# EasyEDA schematic SCH_ZeeShield - GW Zb Shield For ESP32 ETH_2021-08-23.json

## Sheets
1 Main: TITLE: ZeeShield - GW Zb Shield For ESP32 ETH; REV: 1.0; Date: 2021-08-19; Sheet: 1/2; Drawn By: TrimVa; Company: Tech4You
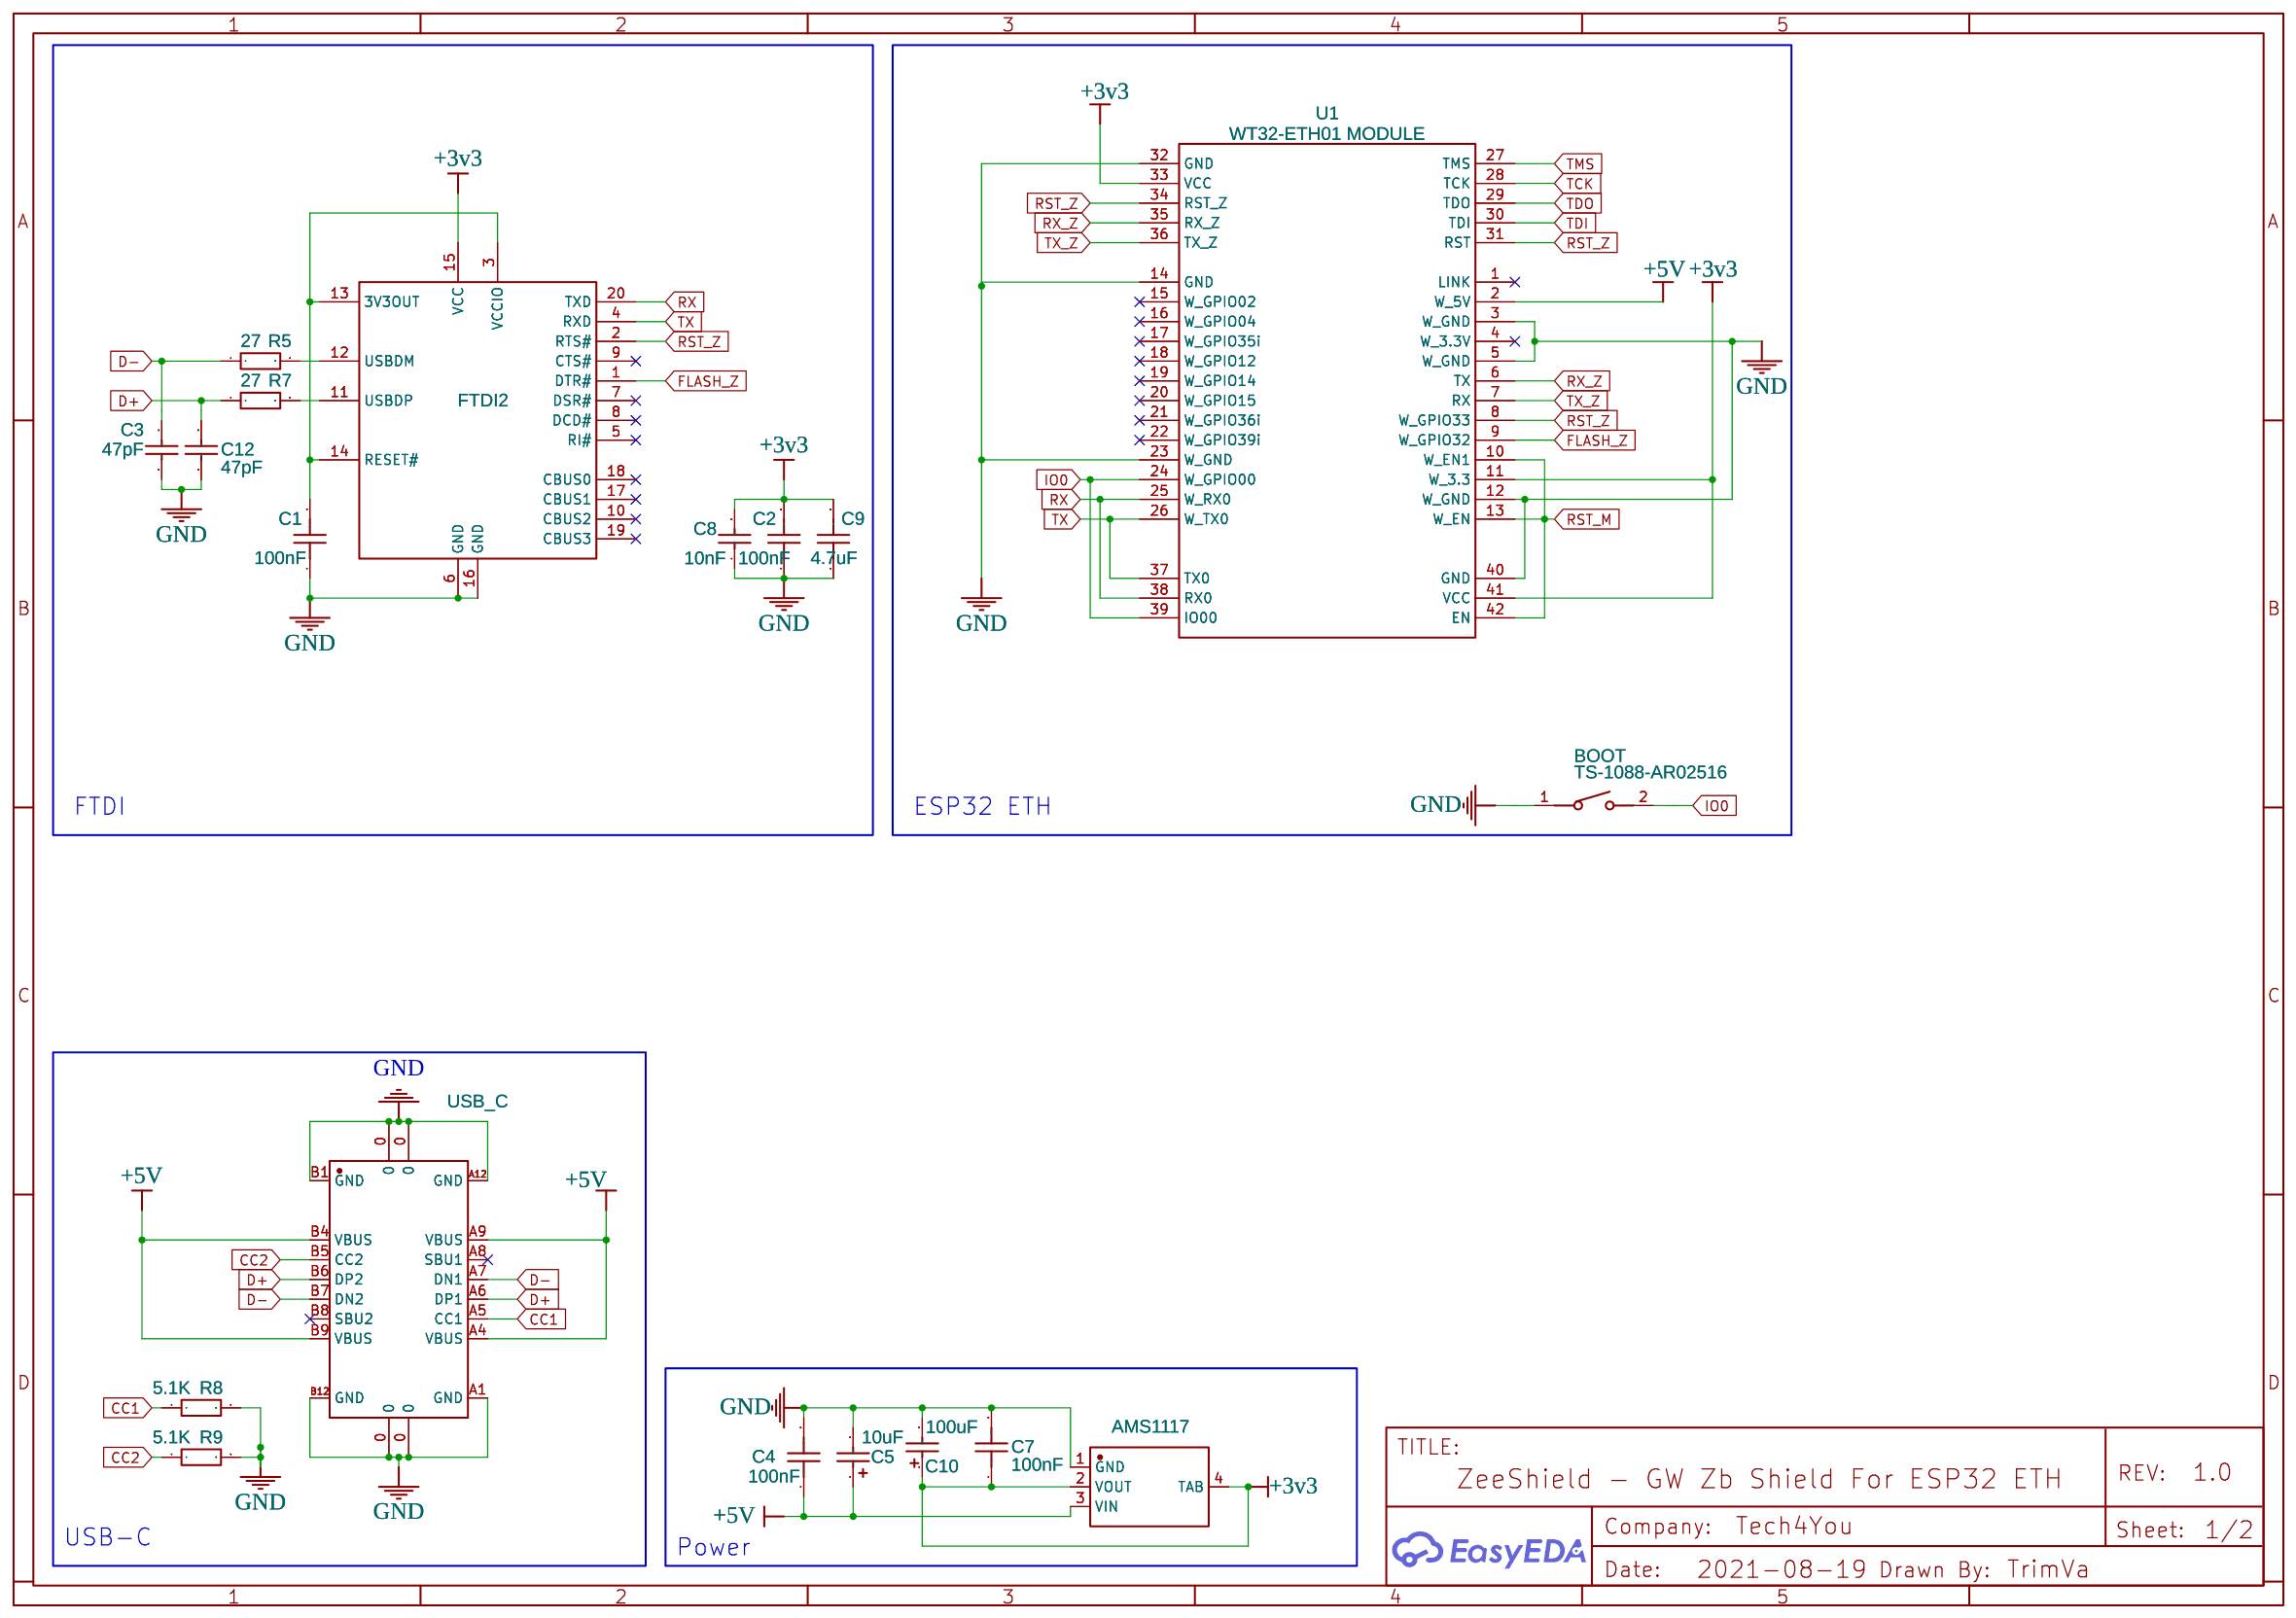
[diagram p0: Main]
2 ZigBee: Date: 2021-08-17; Sheet: 2/2
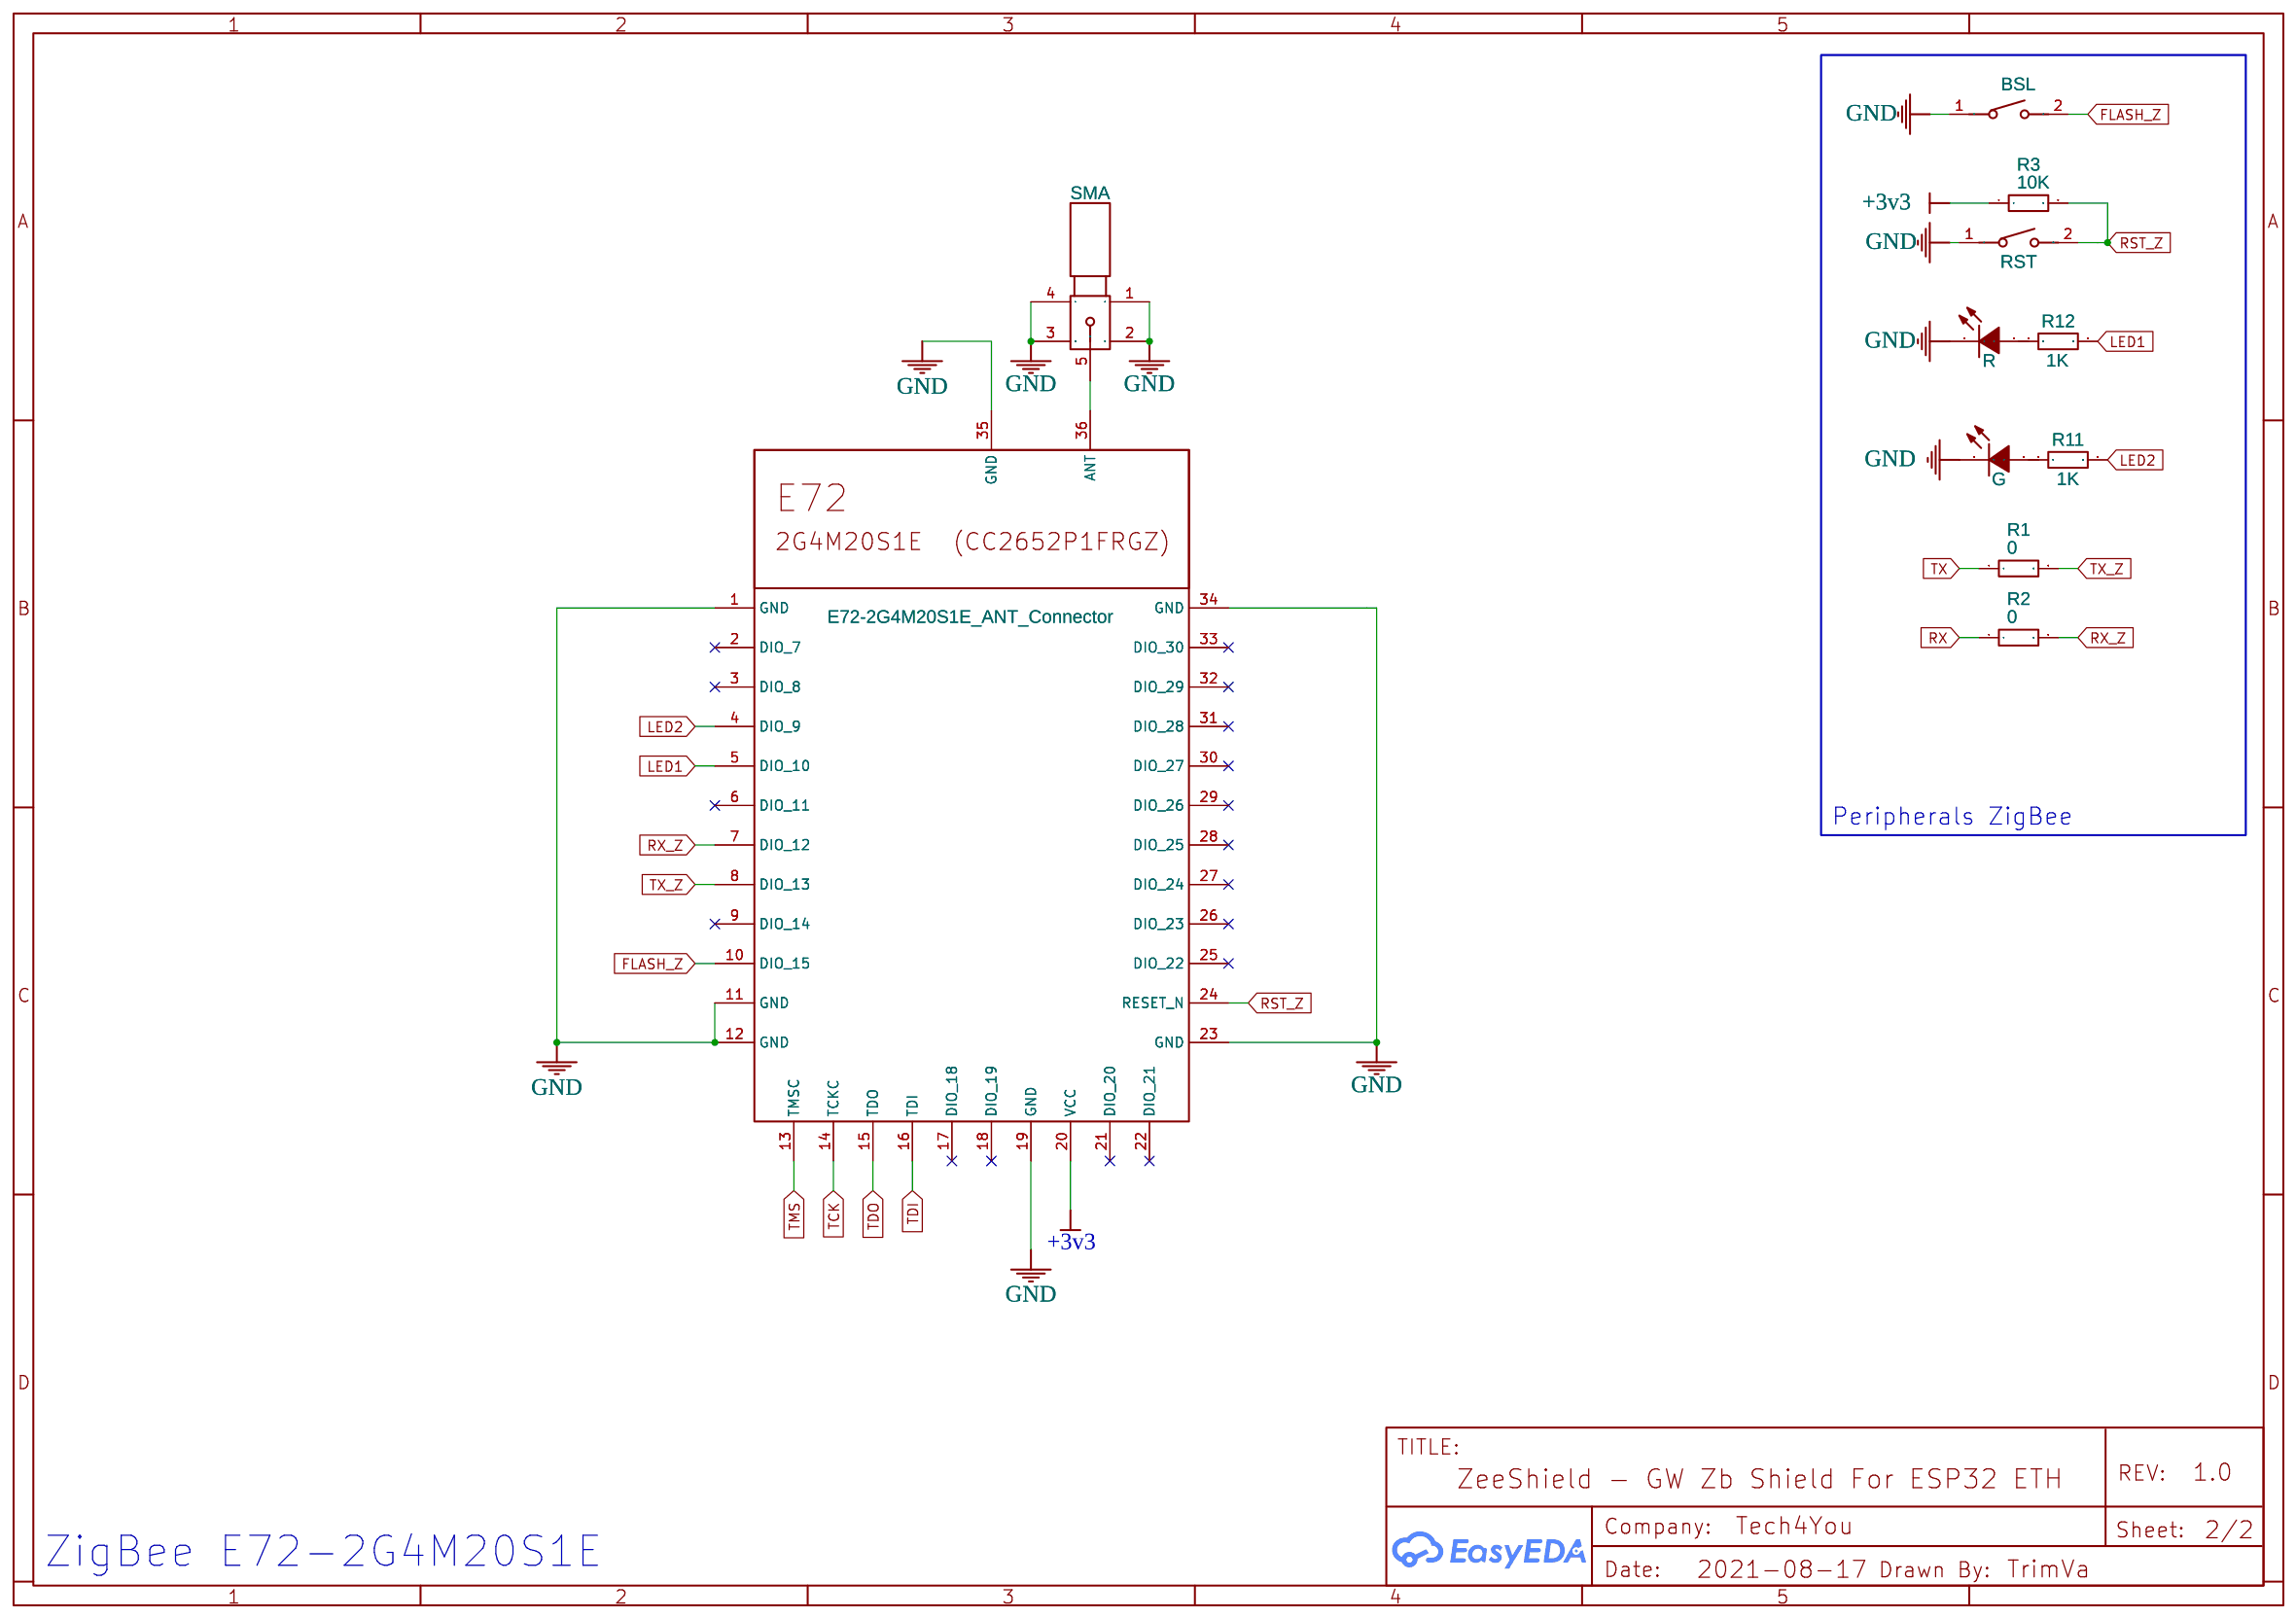
[diagram p1: ZigBee]

## Parts
sheet Main
AMS1117  AMS1117-3.3_C351784  [SOT-223-3_L6.5-W3.4-P2.30-LS7.0-BR]
BOOT  TS-1088-AR02516  [SW-SMD_L4.0-W2.9-LS4.8-1]
C1  100nF  [C0402]
C2  100nF  [C0402]
C3  47pF  [C0402]
C4  100nF  [C0402]
C5  10uF  [CAP-SMD_L3.2-W1.6-R-RD]
C7  100nF  [C0402]
C8  10nF  [C0402]
C9  4.7uF  [C0402]
C10  100uF  [CAP-SMD_L3.2-W1.6-R-RD]
C12  47pF  [C0402]
FTDI2  FT231XS-R  [SSOP-20_L8.6-W3.9-P0.64-LS6.0-BL]
R5  27  [R0402]
R7  27  [R0402]
R8  5.1K  [R0402]
R9  5.1K  [R0402]
U1  WT32-ETH01 MODULE  [WT32-ETH01-M MODULE]
USB_C  TYPE-C-31-M-12  [USB-C_SMD-TYPE-C-31-M-12]
sheet ZigBee
BSL  TS-1088-AR02516  [SW-SMD_L4.0-W2.9-LS4.8-1]
G  G  [LED0805-RD]
GND1  E72-2G4M20S1E_ANT_Connector  [E72-2G4M20S1E ANT_CONNECTOR]
R  R  [LED0805-RD]
R1  0  [R0402]
R2  0  [R0402]
R3  10K  [R0402]
R11  1K  [R0402]
R12  1K  [R0402]
RST  TS-1088-AR02516  [SW-SMD_L4.0-W2.9-LS4.8-1]
SMA  BWSMA-KE-P001  [SMA-SMD_BWSMA-KE-P001]

## Library data of the parts
AMS1117 = AMS1117-3.3_C351784: Supplier: LCSC; Supplier Part: C351784; Manufacturer: PUOLOP; Manufacturer Part: AMS1117-3.3; Contributor: LCSC; JLCPCB Part Class: Extended Part
BOOT BSL RST = TS-1088-AR02516: Supplier: LCSC; Supplier Part: C720478; Manufacturer: XUNPU; Contributor: LCSC; JLCPCB Part Class: Extended Part
C1 C2 C4 C7 = TCC0402X7R104K160AT: Supplier: LCSC; Supplier Part: C392963; Manufacturer: CCTC; Contributor: LCSC; JLCPCB Part Class: Extended Part
C3 C12 = CC0402JRNPO9BN470: Supplier: LCSC; Manufacturer: YAGEO; Supplier Part: C60137
C5 = TAJA106K016RNJ: Supplier: LCSC; Manufacturer: AVX; Supplier Part: C7171; JLCPCB Part Class: Basic Part
C8 = CC0402KRX7R9BB103: Supplier: LCSC; Manufacturer: YAGEO; Supplier Part: C60133
C9 = CL05A475MQ5NRNC_C307423: Supplier: LCSC; Supplier Part: C307423; Manufacturer: Samsung Electro-Mechanics; Manufacturer Part: CL05A475MQ5NRNC; Contributor: LCSC; JLCPCB Part Class: Extended Part
C10 = T490A107M006ATE800: Supplier: LCSC; Manufacturer: KEMET; Supplier Part: C122251; JLCPCB Part Class: Extended Part
FTDI2 = FT231XS-R: Supplier: LCSC; Manufacturer: FTDI; Contributor: LCSC; Supplier Part: C132160; JLCPCB Part Class: Extended Part
R5 R7 = 0402WGJ0270TCE: Supplier: LCSC; Manufacturer: UniOhm; Supplier Part: C25156; JLCPCB Part Class: Extended Part
R8 R9 = RC-02W512JT: Supplier: LCSC; Supplier Part: C258132; Manufacturer: Guangdong Fenghua Advanced Tech; Contributor: LCSC; JLCPCB Part Class: Extended Part
U1 = WT32-ETH01 MODULE: Manufacturer: Wireless-Tag; Manufacturer Part: WT32-ETH01; Supplier Part: WT32-ETH01; link: http://www.wireless-tag.com/wp-content/uploads/2020/08/WT32-ETH01规格书V1.2EN（英文）.pdf; Contributor: Antongsm
USB_C = TYPE-C-31-M-12: Supplier: LCSC; Supplier Part: C165948; Manufacturer: Rectangular Connectors - Contacts; Contributor: LCSC; JLCPCB Part Class: Extended Part
G = 0805G (Green): Supplier: LCSC; Manufacturer: KENTO; Supplier Part: C2297; JLCPCB Part Class: Basic Part
GND1 = E72-2G4M20S1E_ANT_Connector: Manufacturer: Texas Instruments; Manufacturer Part: CC2652P1FRGZ; Supplier: EBYTE; Supplier Part: E72-2G4M20S1E; link: https://www.ebyte.com/en/product-view-news.aspx?id=1002; Contributor: tsura.evgeniy; Manual: https://www.ebyte.com/en/downpdf.aspx?id=1002
R = FC-2012HRK-620D: Supplier: LCSC; Manufacturer: NATIONSTAR; Supplier Part: C84256; JLCPCB Part Class: Basic Part
R1 R2 = RTT02000JTH: Supplier: LCSC; Manufacturer: RALEC; Supplier Part: C102746; JLCPCB Part Class: Extended Part
R3 = RC-02W103JT_C140214: Supplier: LCSC; Supplier Part: C140214; Manufacturer: Guangdong Fenghua Advanced Tech; Manufacturer Part: RC-02W103JT; Contributor: LCSC; JLCPCB Part Class: Extended Part
R11 R12 = 0402WGF1001TCE: Supplier: LCSC; Manufacturer: UniOhm; Supplier Part: C11702; JLCPCB Part Class: Basic Part
SMA = BWSMA-KE-P001: Supplier: LCSC; Supplier Part: C496550; Manufacturer: BAT WIRELESS; Contributor: LCSC; JLCPCB Part Class: Extended Part

## Nets
+3v3: AMS1117.2(VOUT) AMS1117.4(TAB) C2.2 C7.1 C8.2 C9.2 C10.1 FTDI2.15(VCC) GND1.20(VCC) R3.1 U1.11(W_3.3) U1.33(VCC) U1.41(VCC)
+5V: AMS1117.3(VIN) C4.1 C5.1 U1.2(W_5V) USB_C.A4(VBUS) USB_C.A9(VBUS) USB_C.B4(VBUS) USB_C.B9(VBUS)
GND: AMS1117.1(GND) BOOT.1 BSL.1 C1.1 C2.1 C3.1 C4.2 C5.2 C7.2 C8.1 C9.1 C10.2 C12.1 FTDI2.6(GND) FTDI2.16(GND) G.1(K) GND1.1(GND) GND1.11(GND) GND1.12(GND) GND1.19(GND) GND1.23(GND) GND1.34(GND) GND1.35(GND) R.1(-) R8.2 R9.2 RST.1 SMA.1 SMA.2 SMA.3 SMA.4 U1.3(W_GND) U1.5(W_GND) U1.12(W_GND) U1.14(GND) U1.23(W_GND) U1.32(GND) U1.40(GND) USB_C.0 USB_C.A1(GND) USB_C.A12(GND) USB_C.B1(GND) USB_C.B12(GND)
CC1: R8.1 USB_C.A5(CC1)
CC2: R9.1 USB_C.B5(CC2)
D+: C12.2 R7.1 USB_C.A6(DP1) USB_C.B6(DP2)
D-: C3.2 R5.1 USB_C.A7(DN1) USB_C.B7(DN2)
FLASH_Z: BSL.2 FTDI2.1(DTR#) GND1.10(DIO_15) U1.9(W_GPIO32)
IO0: BOOT.2 U1.24(W_GPIO00) U1.39(IO00)
LED1: GND1.5(DIO_10) R12.2
LED2: GND1.4(DIO_9) R11.2
RST_M: U1.10(W_EN1) U1.13(W_EN) U1.42(EN)
RST_Z: FTDI2.2(RTS#) GND1.24(RESET_N) R3.2 RST.2 U1.8(W_GPIO33) U1.31(RST) U1.34(RST_Z)
RX: FTDI2.20(TXD) R2.1 U1.25(W_RX0) U1.38(RX0)
RX_Z: GND1.7(DIO_12) R2.2 U1.6(TX) U1.35(RX_Z)
TCK: GND1.14(TCKC) U1.28(TCK)
TDI: GND1.16(TDI) U1.30(TDI)
TDO: GND1.15(TDO) U1.29(TDO)
TMS: GND1.13(TMSC) U1.27(TMS)
TX: FTDI2.4(RXD) R1.1 U1.26(W_TX0) U1.37(TX0)
TX_Z: GND1.8(DIO_13) R1.2 U1.7(RX) U1.36(TX_Z)
Net-(C1-2): C1.2 FTDI2.3(VCCIO) FTDI2.13(3V3OUT) FTDI2.14(RESET#)
Net-(FTDI2-11): FTDI2.11(USBDP) R7.2
Net-(FTDI2-12): FTDI2.12(USBDM) R5.2
Net-(G-2): G.2(A) R11.1
Net-(GND1-36): GND1.36(ANT) SMA.5
Net-(R-2): R.2(+) R12.1

Not connected (* = marked no-connect by the designer): FTDI2 5(RI#)* 7(DSR#)* 8(DCD#)* 9(CTS#)* 10(CBUS2)* 17(CBUS1)* 18(CBUS0)* 19(CBUS3)*; GND1 2(DIO_7)* 3(DIO_8)* 6(DIO_11)* 9(DIO_14)* 17(DIO_18)* 18(DIO_19)* 21(DIO_20)* 22(DIO_21)* 25(DIO_22)* 26(DIO_23)* 27(DIO_24)* 28(DIO_25)* 29(DIO_26)* 30(DIO_27)* 31(DIO_28)* 32(DIO_29)* 33(DIO_30)*; U1 1(LINK)* 4(W_3.3V)* 15(W_GPIO02)* 16(W_GPIO04)* 17(W_GPIO35i)* 18(W_GPIO12)* 19(W_GPIO14)* 20(W_GPIO15)* 21(W_GPIO36i)* 22(W_GPIO39i)*; USB_C A8(SBU1)* B8(SBU2)*

## Notes on the sheets
sheet 1
- FTDI
- ESP32 ETH
- USB-C
- Power
sheet 2
- Peripherals ZigBee
- ZigBee E72-2G4M20S1E
